# EAGLE schematic 7seg_snd2536 (EAGLE 7.1.0)
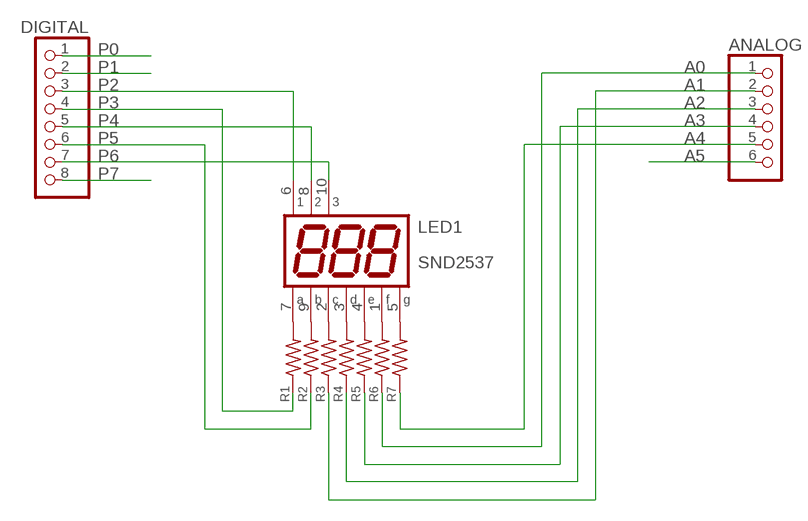
[diagram p0: schematic, sheet 1]

## Parts
ANALOG  PINHD-1X6  [1X06]
DIGITAL  PINHD-1X8TH  [1X08-TH]
LED1  SND2537  [SND2537-PKG]
R1  R-US_0207/10  [0207/10]
R2  R-US_0207/10  [0207/10]
R3  R-US_0207/10  [0207/10]
R4  R-US_0207/10  [0207/10]
R5  R-US_0207/10  [0207/10]
R6  R-US_0207/10  [0207/10]
R7  R-US_0207/10  [0207/10]

## Nets
A0: ANALOG.1 R6.1
A1: ANALOG.2 R3.1
A2: ANALOG.3 R4.1
A3: ANALOG.4 R5.1
A4: ANALOG.5 R7.1
A5: ANALOG.6
N$9: LED1.7(A) R1.2
N$10: LED1.9(B) R2.2
N$11: LED1.2(C) R3.2
N$12: LED1.3(D) R4.2
N$13: LED1.4(E) R5.2
N$14: LED1.1(F) R6.2
N$15: LED1.5(G) R7.2
P0: DIGITAL.1
P1: DIGITAL.2
P2: DIGITAL.3 LED1.6
P3: DIGITAL.4 R1.1
P4: DIGITAL.5 LED1.8
P5: DIGITAL.6 R2.1
P6: DIGITAL.7 LED1.10
P7: DIGITAL.8

## Library data of the parts
ANALOG = pinhead:PINHD-1X6: PIN HEADER
DIGITAL = SmartPrj:PINHD-1X8: PIN HEADER
LED1 = led-7-seg-samkwang:SND2537: SND2537 Triple Digit Seven-Segment Display (anode common); OC_FARNELL: unknown; OC_NEWARK: unknown
R1-R7 = resistor:R-US_: RESISTOR, American symbol